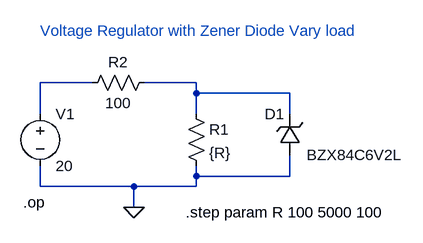
[diagram p0: schematic Voltage regulator with zener 2 vary load.asc]
Voltage regulator with zener 2 vary load.asc, the LTspice schematic file:
Version 4
SHEET 1 880 680
WIRE 128 112 48 112
WIRE 288 112 208 112
WIRE 288 128 288 112
WIRE 432 128 288 128
WIRE 48 160 48 112
WIRE 288 160 288 128
WIRE 432 160 432 128
WIRE 288 256 288 240
WIRE 432 256 432 224
WIRE 432 256 288 256
WIRE 48 272 48 240
WIRE 192 272 48 272
WIRE 288 272 288 256
WIRE 288 272 192 272
WIRE 192 304 192 272
FLAG 192 304 0
SYMBOL res 272 144 R0
SYMATTR InstName R1
SYMATTR Value {R}
SYMBOL voltage 48 144 R0
WINDOW 123 0 0 Left 0
WINDOW 39 0 0 Left 0
SYMATTR InstName V1
SYMATTR Value 20
SYMBOL zener 448 224 R180
WINDOW 0 24 64 Left 2
WINDOW 3 -157 1 Left 2
SYMATTR InstName D1
SYMATTR Value BZX84C6V2L
SYMATTR Description Diode
SYMATTR Type diode
SYMBOL res 112 128 R270
WINDOW 0 32 56 VTop 2
WINDOW 3 0 56 VBottom 2
SYMATTR InstName R2
SYMATTR Value 100
TEXT 48 32 Left 2 ;Voltage Regulator with Zener Diode Vary load
TEXT 22 296 Left 2 !.op
TEXT 272 312 Left 2 !.step param R 100 5000 100

The netlist it stands for:
* Voltage regulator with zener 2 vary load.asc
R1 N002 0 {R}
V1 N001 0 20
D1 0 N002 BZX84C6V2L
R2 N001 N002 100
.model D D
.lib standard.dio
* Voltage Regulator with Zener Diode Vary load
.op
.step param R 100 5000 100
.backanno
.end